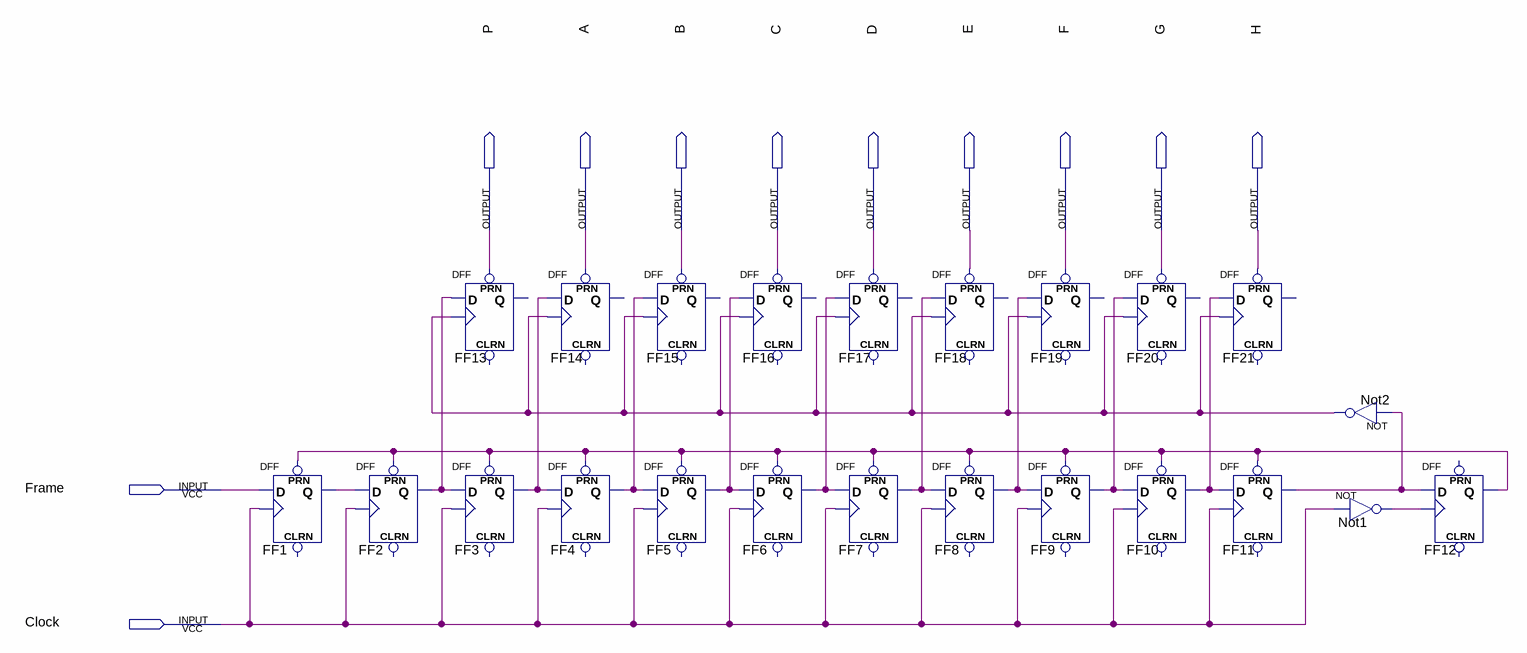
[diagram p0: schematic sheet]
// Quartus schematic ConversorSerial-Paralelo.bdf as structural Verilog: 23 symbols, 11 pins
module \ConversorSerial-Paralelo  (
  input  Frame,
  input  Clock,
  output P,
  output A,
  output B,
  output C,
  output D,
  output E,
  output F,
  output G,
  output H
);

  wire FF1_q, FF2_q, FF3_q, FF4_q, FF5_q, FF6_q, FF7_q, FF8_q, FF9_q, FF10_q, FF11_q, FF12_q, Not1_out,
       Not2_out;

  DFF FF1 (.CLK(Clock), .D(Frame), .PRN(FF12_q), .Q(FF1_q));  // open: CLRN
  DFF FF2 (.CLK(Clock), .D(FF1_q), .PRN(FF12_q), .Q(FF2_q));  // open: CLRN
  DFF FF13 (.CLK(Not2_out), .D(FF2_q), .PRN(P));  // open: CLRN, Q
  DFF FF3 (.CLK(Clock), .D(FF2_q), .PRN(FF12_q), .Q(FF3_q));  // open: CLRN
  DFF FF14 (.CLK(Not2_out), .D(FF3_q), .PRN(A));  // open: CLRN, Q
  DFF FF4 (.CLK(Clock), .D(FF3_q), .PRN(FF12_q), .Q(FF4_q));  // open: CLRN
  DFF FF15 (.CLK(Not2_out), .D(FF4_q), .PRN(B));  // open: CLRN, Q
  DFF FF5 (.CLK(Clock), .D(FF4_q), .PRN(FF12_q), .Q(FF5_q));  // open: CLRN
  DFF FF16 (.CLK(Not2_out), .D(FF5_q), .PRN(C));  // open: CLRN, Q
  DFF FF6 (.CLK(Clock), .D(FF5_q), .PRN(FF12_q), .Q(FF6_q));  // open: CLRN
  DFF FF17 (.CLK(Not2_out), .D(FF6_q), .PRN(D));  // open: CLRN, Q
  DFF FF7 (.CLK(Clock), .D(FF6_q), .PRN(FF12_q), .Q(FF7_q));  // open: CLRN
  DFF FF18 (.CLK(Not2_out), .D(FF7_q), .PRN(E));  // open: CLRN, Q
  DFF FF8 (.CLK(Clock), .D(FF7_q), .PRN(FF12_q), .Q(FF8_q));  // open: CLRN
  DFF FF19 (.CLK(Not2_out), .D(FF8_q), .PRN(F));  // open: CLRN, Q
  DFF FF9 (.CLK(Clock), .D(FF8_q), .PRN(FF12_q), .Q(FF9_q));  // open: CLRN
  DFF FF20 (.CLK(Not2_out), .D(FF9_q), .PRN(G));  // open: CLRN, Q
  DFF FF10 (.CLK(Clock), .D(FF9_q), .PRN(FF12_q), .Q(FF10_q));  // open: CLRN
  DFF FF21 (.CLK(Not2_out), .D(FF10_q), .PRN(H));  // open: CLRN, Q
  DFF FF11 (.CLK(Clock), .D(FF10_q), .PRN(FF12_q), .Q(FF11_q));  // open: CLRN
  not Not2 (Not2_out, FF11_q);
  not Not1 (Not1_out, Clock);
  DFF FF12 (.CLK(Not1_out), .D(FF11_q), .Q(FF12_q));  // open: CLRN, PRN
endmodule
